# Altium project IPG.PrjPcb (part 9 of 13)

## Sheet 11-Stimulation.SchDoc: Stimulation
size A2; DocumentNumber: 11; SheetNumber: 11; SheetTotal: 15
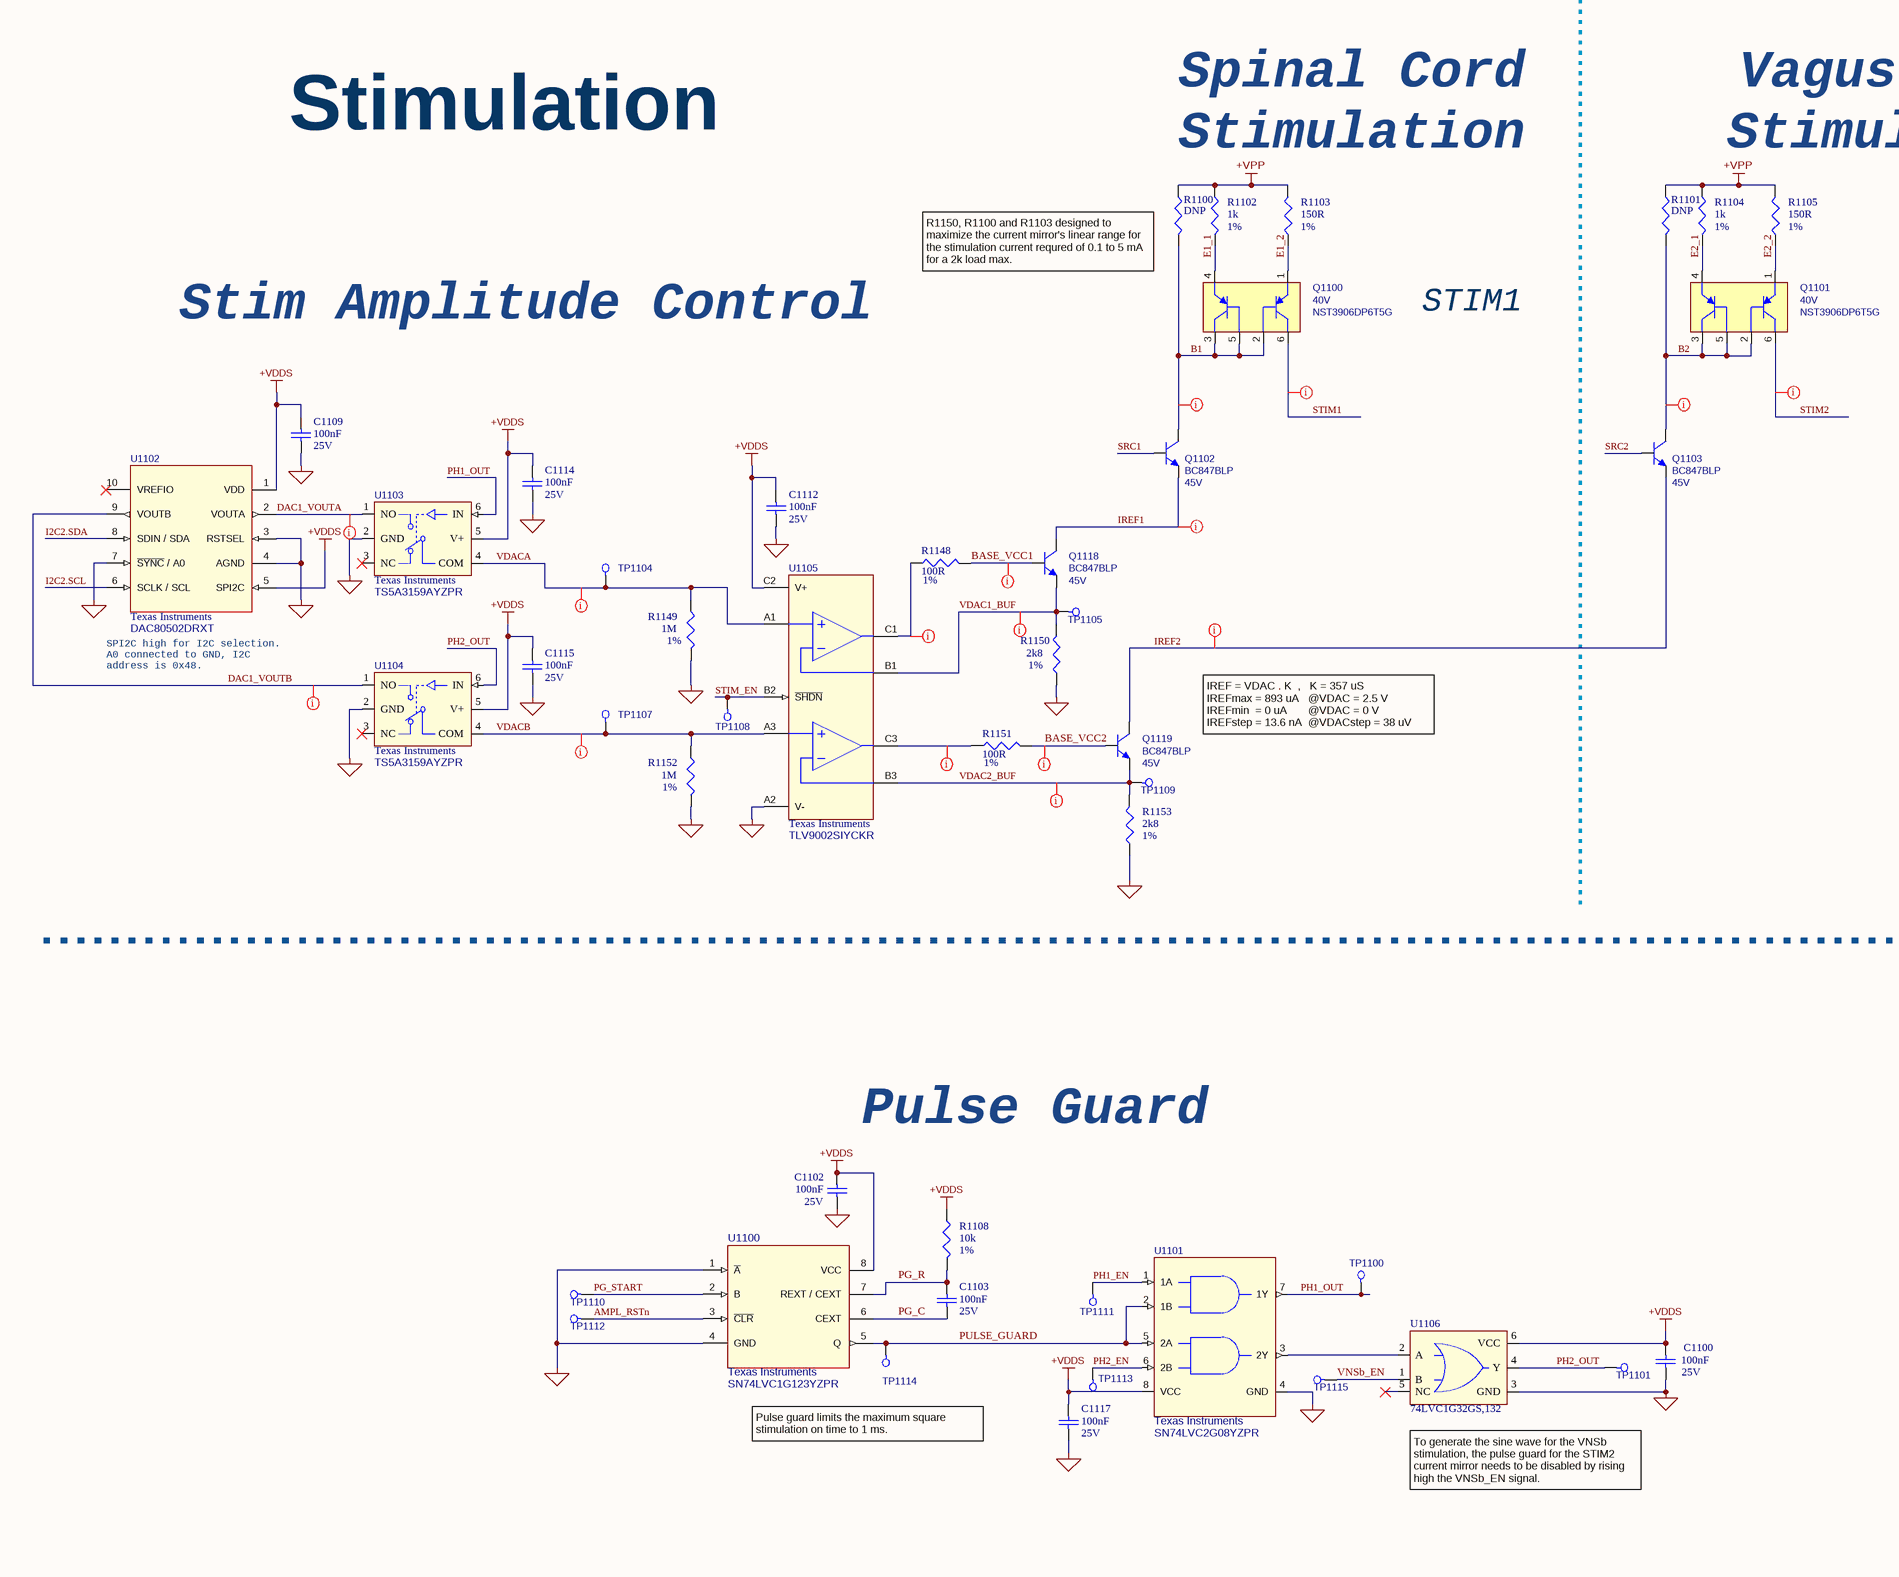
[diagram p23: 11-Stimulation.SchDoc, left]
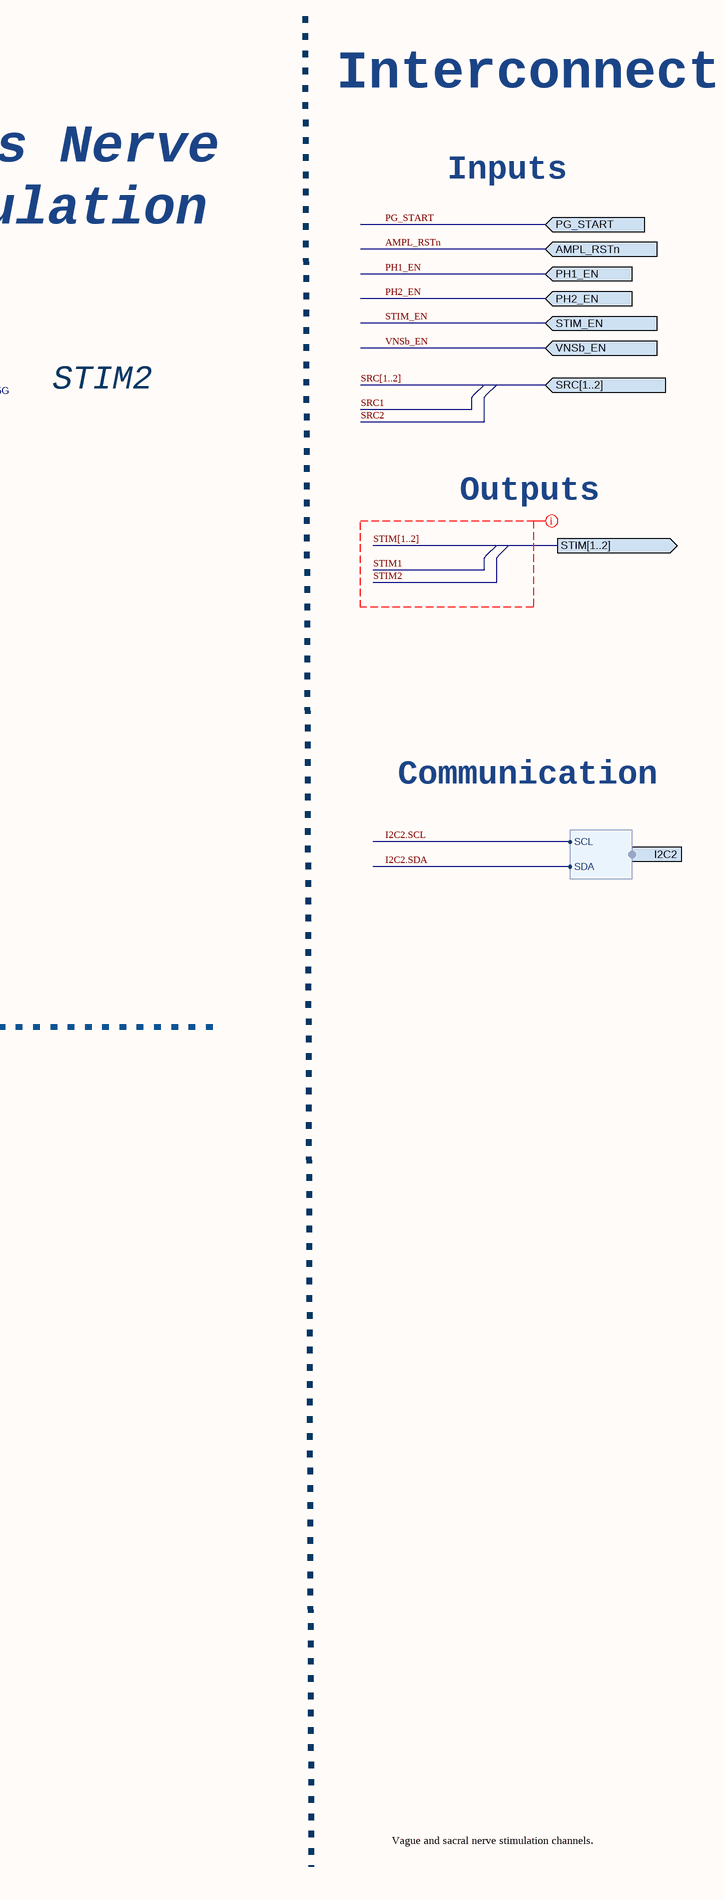
[diagram p24: 11-Stimulation.SchDoc, right]

### Parts
C1100  value 100nF  Rated DC Voltage (URdc): 25V  [C0201_C]  (hidden comment: GRM033R61E104KE14J)
C1102  value 100nF  Rated DC Voltage (URdc): 25V  [C0201_C]  (hidden comment: GRM033R61E104KE14J)
C1103  value 100nF  Rated DC Voltage (URdc): 25V  [C0201_C]  (hidden comment: GRM033R61E104KE14J)
C1109  value 100nF  Rated DC Voltage (URdc): 25V  [C0201_C]  (hidden comment: GRM033R61E104KE14J)
C1112  value 100nF  Rated DC Voltage (URdc): 25V  [C0201_C]  (hidden comment: GRM033R61E104KE14J)
C1114  value 100nF  Rated DC Voltage (URdc): 25V  [C0201_C]  (hidden comment: GRM033R61E104KE14J)
C1115  value 100nF  Rated DC Voltage (URdc): 25V  [C0201_C]  (hidden comment: GRM033R61E104KE14J)
C1117  value 100nF  Rated DC Voltage (URdc): 25V  [C0201_C]  (hidden comment: GRM033R61E104KE14J)
Q1100  Rating: 40V  [DIODESINC_SOT-963-6]  (hidden comment: NST3906DP6T5G)
Q1101  Rating: 40V  [DIODESINC_SOT-963-6]  (hidden comment: NST3906DP6T5G)
Q1102  value BC847BLP  Rating: 45V  [DIODESINC_X1-DFN1006-3]  (hidden comment: BC847BLP-7B)
Q1103  value BC847BLP  Rating: 45V  [DIODESINC_X1-DFN1006-3]  (hidden comment: BC847BLP-7B)
Q1118  value BC847BLP  Rating: 45V  [DIODESINC_X1-DFN1006-3]  (hidden comment: BC847BLP-7B)
Q1119  value BC847BLP  Rating: 45V  [DIODESINC_X1-DFN1006-3]  (hidden comment: BC847BLP-7B)
R1100  value DNP  [R0201_C]  (hidden comment: RES_DNP_0201)  (no BOM)
R1101  value DNP  [R0201_C]  (hidden comment: RES_DNP_0201)  (no BOM)
R1102  value 1k  Tolerance: 1%  [R0201_C]  (hidden comment: CRCW02011K00FNED)
R1103  value 150R  Tolerance: 1%  [R0201_C]  (hidden comment: CRCW0201150RFNED)
R1104  value 1k  Tolerance: 1%  [R0201_C]  (hidden comment: CRCW02011K00FNED)
R1105  value 150R  Tolerance: 1%  [R0201_C]  (hidden comment: CRCW0201150RFNED)
R1108  value 10k  Tolerance: 1%  [R0201_C]  (hidden comment: CRCW020110K0FNED)
R1148  value 100R  Tolerance: 1%  [R0201_C]  (hidden comment: CRCW0201100RFNED)
R1149  value 1M  Tolerance: 1%  [R0201_C]  (hidden comment: CRCW02011M00FNED)
R1150  value 2k8  Tolerance: 1%  [R0201_C]  (hidden comment: CRCW02012K80FNED)
R1151  value 100R  Tolerance: 1%  [R0201_C]  (hidden comment: CRCW0201100RFNED)
R1152  value 1M  Tolerance: 1%  [R0201_C]  (hidden comment: CRCW02011M00FNED)
R1153  value 2k8  Tolerance: 1%  [R0201_C]  (hidden comment: CRCW02012K80FNED)
TP1100  Test Point  [testpad_0.9mm]  (value not drawn)  (no BOM)
TP1101  Test Point  [testpad_0.9mm]  (value not drawn)  (no BOM)
TP1104  Test Point  [testpad_0.9mm]  (value not drawn)  (no BOM)
TP1105  Test Point  [testpad_0.9mm]  (value not drawn)  (no BOM)
TP1107  Test Point  [testpad_0.9mm]  (value not drawn)  (no BOM)
TP1108  Test Point  [testpad_0.9mm]  (value not drawn)  (no BOM)
TP1109  Test Point  [testpad_0.9mm]  (value not drawn)  (no BOM)
TP1110  Test Point  [testpad_0.9mm]  (value not drawn)  (no BOM)
TP1111  Test Point  [testpad_0.9mm]  (value not drawn)  (no BOM)
TP1112  Test Point  [testpad_0.9mm]  (value not drawn)  (no BOM)
TP1113  Test Point  [testpad_0.9mm]  (value not drawn)  (no BOM)
TP1114  Test Point  [testpad_0.9mm]  (value not drawn)  (no BOM)
TP1115  Test Point  [testpad_0.9mm]  (value not drawn)  (no BOM)
U1100  Manufacturer: Texas Instruments  [TI_YZP0008]  (hidden comment: SN74LVC1G123YZPR)
U1101  Manufacturer: Texas Instruments  [TI_YZP0008]  (hidden comment: SN74LVC2G08YZPR)
U1102  Manufacturer: Texas Instruments  [TI_DRX0010A]  (hidden comment: DAC80502DRXT)
U1103  Manufacturer: Texas Instruments  [TI_YZP6]  (hidden comment: TS5A3159AYZPR)
U1104  Manufacturer: Texas Instruments  [TI_YZP6]  (hidden comment: TS5A3159AYZPR)
U1105  Manufacturer: Texas Instruments  [TI_YCK0009]  (hidden comment: TLV9002SIYCKR)
U1106  74LVC1G32GS,132  [74LVC1G3157GS132]

### Ports
AMPL_RSTn (in), I2C2 (harness I2C), PG_START (in), PH1_EN (in), PH2_EN (in), SRC[1..2] (in), STIM[1..2] (out), STIM_EN (in), VNSb_EN (in)

### Harnesses
I2C: SDA, SCL

### Nets
+VDDS: C1100.2 C1102.2 C1109.2 C1112.2 C1114.2 C1115.2 C1117.2 R1108.1 U1100.8(VCC) U1101.8(VCC) U1102.1(VDD) U1102.5(SPI2C) U1103.5(V+) U1104.5(V+) U1105.C2(V+) U1106.6(VCC)
+VPP: R1100.1 R1101.1 R1102.1 R1103.2 R1104.1 R1105.2
GND: C1100.1 C1102.1 C1109.1 C1112.1 C1114.1 C1115.1 C1117.1 R1149.2 R1150.1 R1152.2 R1153.1 U1100.1(~{A}) U1100.4(GND) U1101.4(GND) U1102.3(RSTSEL) U1102.4(AGND) U1102.7(~{SYNC}_/_A0) U1103.2(GND) U1104.2(GND) U1105.A2(V-) U1106.3(GND)
AMPL_RSTn: TP1112.1 U1100.3(~{CLR}) ; port AMPL_RSTn
B1: Q1100.2(B2) Q1100.3(C1) Q1100.5(B1) Q1102.3(C) R1100.2
B2: Q1101.2(B2) Q1101.3(C1) Q1101.5(B1) Q1103.3(C) R1101.2
BASE_VCC1: Q1118.1(B) R1148.2
BASE_VCC2: Q1119.1(B) R1151.2
DAC1_VOUTA: U1102.2(VOUTA) U1103.1(NO)
DAC1_VOUTB: U1102.9(VOUTB) U1104.1(NO)
E1_1: Q1100.4(E1) R1102.2
E1_2: Q1100.1(E2) R1103.1
E2_1: Q1101.4(E1) R1104.2
E2_2: Q1101.1(E2) R1105.1
I2C2.SCL: U1102.6(SCLK_/_SCL) ; port I2C2.SCL
I2C2.SDA: U1102.8(SDIN_/_SDA) ; port I2C2.SDA
IREF1: Q1102.2(E) Q1118.3(C)
IREF2: Q1103.2(E) Q1119.3(C)
PG_C: C1103.1 U1100.6(CEXT)
PG_R: C1103.2 R1108.2 U1100.7(REXT_/_CEXT)
PG_START: TP1110.1 U1100.2(B) ; port PG_START
PH1_EN: TP1111.1 U1101.1(1A) ; port PH1_EN
PH1_OUT: TP1100.1 U1101.7(1Y) U1103.6(IN)
PH2_EN: TP1113.1 U1101.6(2B) ; port PH2_EN
PH2_OUT: TP1101.1 U1104.6(IN) U1106.4(Y)
PULSE_GUARD: TP1114.1 U1100.5(Q) U1101.2(1B) U1101.5(2A)
SRC1: Q1102.1(B)
SRC2: Q1103.1(B)
STIM1: Q1100.6(C2)
STIM2: Q1101.6(C2)
STIM_EN: TP1108.1 U1105.B2(~{SHDN}) ; port STIM_EN
VDAC1_BUF: Q1118.2(E) R1150.2 TP1105.1 U1105.B1(IN1-)
VDAC2_BUF: Q1119.2(E) R1153.2 TP1109.1 U1105.B3(IN2-)
VDACA: R1149.1 TP1104.1 U1103.4(COM) U1105.A1(IN1+)
VDACB: R1152.1 TP1107.1 U1104.4(COM) U1105.A3(IN2+)
VNSb_EN: TP1115.1 U1106.1(B) ; port VNSb_EN
NetR1148_1: R1148.1 U1105.C1(OUT1)
NetR1151_1: R1151.1 U1105.C3(OUT2)
NetU1101_3: U1101.3(2Y) U1106.2(A)

Not connected (* = marked no-connect by the designer): U1102 10(VREFIO)*; U1103 3(NC)*; U1104 3(NC)*; U1106 5(NC)*

### Buses and harness runs
bus SRC[1..2] = port SRC[1..2]
bus STIM[1..2] = port STIM[1..2]

### Layout directives
net class ANALOG: B1, B2, BASE_VCC1, BASE_VCC2, DAC1_VOUTA, DAC1_VOUTB, IREF1, IREF2, NetR1148_1, NetR1151_1, STIM1, STIM2, STIM[1..2], VDAC1_BUF, VDAC2_BUF, VDACA, VDACB

### Notes on the sheet
- Interconnect
- Spinal Cord
- Vagus Nerve
- Inputs
- Stimulation
- (near R1100) R1150, R1100 and R1103 designed to maximize the current mirror's linear range for the stimulation current requred of 0.1 to 5 mA for a 2k load max.
- Stim Amplitude Control
- STIM1
- STIM2
- Outputs
- SPI2C high for I2C selection. A0 connected to GND, I2C address is 0x48.
- Communication
- IREF = VDAC . K  ,   K = 357 uS
  IREFmax = 893 uA   @VDAC = 2.5 V
  IREFmin  = 0 uA       @VDAC = 0 V
  IREFstep = 13.6 nA  @VDACstep = 38 uV
- Pulse Guard
- Pulse guard limits the maximum square stimulation on time to 1 ms.
- (near U1106) To generate the sine wave for the VNSb stimulation, the pulse guard for the STIM2 current mirror needs to be disabled by rising high the VNSb_EN signal.
- Vague and sacral nerve stimulation channels.
- Project:
- Schematic:
- Design by:
- Date:
- Ver:
- .
- Comments:
- Reviewed by:

### Library data of the parts
C1100 C1102 C1103 C1109 C1112 C1114 C1115 C1117 = GRM033R61E104KE14J: as C1003-C1006 on sheet 10-Sensing; Category: Ceramic Capacitors; Supplier: Digikey; Supplier Part Number: 490-14571-1-ND; Manufacturer Part Number: GRM033R61E104KE14J; RoHS: Yes; Stock: 1540851; Pricing: 1=0,1, 10=0,033, 50=0,0192, 100=0,0148, 500=0,01118, 1000=0,00878, 2500=0,00798, 5000=0,00734 (USD); Mounting Technology: Surface Mount; Pins: 2; Dielectric Material: Ceramic; Package Shape: Rectangular; Case/Package: 0201; Terminal Finish: Nickel; Min Operating Temperature: -55°C; Max Operating Temperature: 85°C; JESD-609 Code: e3; Capacitor Type: Ceramic; Tolerance  (fill in as +-): 10%; Package Style: SMTMeter; Packaging: Tape and Reel; Tolerance (fill in as +-): 10%; Temperature Characteristics Code: X5R; Termination: Wraparound; Length: 0.6mm; Width: 0.3mm; Height: 0.3mm; Reach SVHC Compliant: Yes; RoHS Compliant: Yes; ComponentLink1URL: https://psearch.en.murata.com:443/capacitor/product/GRM033R61E104KE14%23.pdf?src-supplier=IHS+Markit; ComponentLink1Description: https://psearch.en.murata.com:443/capacitor/product/GRM033R61E104KE14%23.pdf?src-supplier=IHS+Markit; ComponentLink2URL: http://www.mouser.com/ds/2/281/c02e-2905.pdf?src-supplier=Mouser; ComponentLink2Description: http://www.mouser.com/ds/2/281/c02e-2905.pdf?src-supplier=Mouser; ComponentLink3URL: http://search.murata.co.jp/Ceramy/image/img/A01X/G101/ENG/GRM033R61E104KE14-01.pdf?src-supplier=Digikey; ComponentLink3Description: http://search.murata.co.jp/Ceramy/image/img/A01X/G101/ENG/GRM033R61E104KE14-01.pdf?src-supplier=Digikey; ComponentLink4URL: https://search.murata.co.jp/Ceramy/image/img/A01X/G101/ENG/GRM033R61E104KE14-01.pdf?src-supplier=Digikey; ComponentLink4Description: https://search.murata.co.jp/Ceramy/image/img/A01X/G101/ENG/GRM033R61E104KE14-01.pdf?src-supplier=Digikey; Supplier 1: Arrow Electronics; Supplier Part Number 1: GRM033R61E104KE14J
Q1100 Q1101 = NST3906DP6T5G: TRANS 2PNP 40V 0.2A SOT963; Manufacturer: ON Semi; Medical Grade MFR: TBD; Category: Transistor; Length (mm): 1.00 ±0.05; Medical Grade MFR PN: TBD; PCB Footprint: TBD; Thickness (mm): 0.45 ±0.05; Value: NST3906DP6T5G; Width (mm): 1.00 ±0.05; Package Description: SOT963; Supplier 1: Digi-Key; Supplier Part Number 1: NST3906DP6T5GOSCT-ND; Status: *; Review: *; Manufacturer Part Number: NST3906DP6T5G
Q1102 Q1103 Q1118 Q1119 = BC847BLP-7B: Transistor, NPN, 45V, 100mA, DFN1006; Manufacturer: Diodes Inc; Medical Grade MFR: TBD; Category: Transistor; Length (mm): 1.00 ±0.08; Medical Grade MFR PN: TBD; PCB Footprint: TBD; Thickness (mm): 0.50 ±0.03; Width (mm): 0.60 ±0.08; Supplier 1: Digi-Key; Supplier Part Number 1: BC847BLP-7BDICT-ND; Status: *; Review: *; Manufacturer Part Number: BC847BLP-7B
R1102 R1104 = CRCW02011K00FNED: Fixed Resistor, Metal Glaze/thick Film, 0.05W, 1000ohm, 30V, 1% +/-Tol, 200ppm/Cel, Surface Mount, 0201; Manufacturer: Vishay; Medical Grade MFR: Mini-Systems; Medical Grade MFR PN: MWA96SM-1001F-NS62TR; Power: 50mW; Rated Temperature: 70°C; Temperature Coefficient: 200ppm/°C; Package Height: 0.23mm; Package Length: 0.6mm; Package Width: 0.3mm; Reference Standard: AEC-Q200; Category: Chip SMD Resistors; Supplier: Digikey; Supplier Part Number: 541-1.00KABCT-ND; Manufacturer Part Number: CRCW02011K00FNED; RoHS: Yes; Stock: 303224; Pricing: 1=0,1, 10=0,037, 50=0,0242, 100=0,0204, 500=0,01426, 1000=0,01241, 5000=0,00924 (USD); Mounting Technology: Surface Mount; Pins: 2; Package Shape: Rectangular; Case/Package: 0201; Terminal Finish: Nickel; Min Operating Temperature: -55°C; Max Operating Temperature: 155°C; JESD-609 Code: e3; Resistor Type: FIXED RESISTOR; Construction: Chip; Package Style: SMTMeter; Packaging: Tape and Reel; Technology: METAL GLAZE/THICK FILM; Termination: Wraparound; Working Voltage: 30V; Reach SVHC Compliant: Yes; RoHS Compliant: Yes; ComponentLink1URL: https://datasheet.ciiva.com:443/pdfs/VipMasterIC/IC/VISH/VISH-S-A0002932828/VISH-S-A0002932828-1.pdf?src-supplier=IHS+Markit; ComponentLink1Description: https://datasheet.ciiva.com:443/pdfs/VipMasterIC/IC/VISH/VISH-S-A0002932828/VISH-S-A0002932828-1.pdf?src-supplier=IHS+Markit; ComponentLink2URL: https://datasheet.ciiva.com/7983/1719906-7983324.pdf?src-supplier=Element14; ComponentLink2Description: https://datasheet.ciiva.com/7983/1719906-7983324.pdf?src-supplier=Element14; ComponentLink3URL: https://datasheet.ciiva.com/7983/1719906-7983323.pdf?src-supplier=Element14; ComponentLink3Description: https://datasheet.ciiva.com/7983/1719906-7983323.pdf?src-supplier=Element14; ComponentLink4URL: https://datasheet.ciiva.com/22692/1719906-22692751.pdf?src-supplier=Element14; ComponentLink4Description: https://datasheet.ciiva.com/22692/1719906-22692751.pdf?src-supplier=Element14; ComponentLink5URL: https://datasheet.ciiva.com/22665/1825492-22665818.pdf?src-supplier=Element14; ComponentLink5Description: https://datasheet.ciiva.com/22665/1825492-22665818.pdf?src-supplier=Element14; ComponentLink6URL: https://datasheet.ciiva.com/2474/crcw0201e3-2474801.pdf?src-supplier=Digikey; ComponentLink6Description: https://datasheet.ciiva.com/2474/crcw0201e3-2474801.pdf?src-supplier=Digikey; ComponentLink7URL: https://datasheet.ciiva.com/2474/crcw0201e3-2474802.pdf?src-supplier=Digikey; ComponentLink7Description: https://datasheet.ciiva.com/2474/crcw0201e3-2474802.pdf?src-supplier=Digikey; ComponentLink8URL: https://datasheet.ciiva.com/2474/crcw0201e3-2474800.pdf?src-supplier=Digikey; ComponentLink8Description: https://datasheet.ciiva.com/2474/crcw0201e3-2474800.pdf?src-supplier=Digikey; ComponentLink9URL: https://datasheet.ciiva.com/22871/70202042-22871422.pdf?src-supplier=Allied+Electronics; ComponentLink9Description: https://datasheet.ciiva.com/22871/70202042-22871422.pdf?src-supplier=Allied+Electronics; ComponentLink10URL: https://datasheet.ciiva.com/3255/crcw0201e3-3255929.pdf?src-supplier=Avnet; ComponentLink10Description: https://datasheet.ciiva.com/3255/crcw0201e3-3255929.pdf?src-supplier=Avnet; Supplier 1: Arrow Electronics; Supplier Part Number 1: CRCW02011K00FNED
R1103 R1105 = CRCW0201150RFNED: Fixed Resistor, Metal Glaze/thick Film, 0.05W, 150ohm, 30V, 1% +/-Tol, 200ppm/Cel, Surface Mount, 0201; Manufacturer: Vishay; Medical Grade MFR: Mini-Systems; Medical Grade MFR PN: MWA96SM-1500F-NS62TR; Power: 50mW; Rated Temperature: 70°C; Temperature Coefficient: 200ppm/°C; Package Height: 0.23mm; Package Length: 0.6mm; Package Width: 0.3mm; Reference Standard: AEC-Q200; Category: Chip SMD Resistors; Supplier: Digikey; Supplier Part Number: 541-CRCW0201150RFNEDCT-ND; Manufacturer Part Number: CRCW0201150RFNED; RoHS: Yes; Stock: 19000; Pricing: 1=0,1, 10=0,037, 50=0,0242, 100=0,0204, 500=0,01426, 1000=0,01241, 5000=0,00924 (USD); Mounting Technology: Surface Mount; Pins: 2; Package Shape: Rectangular; Case/Package: 0201; Terminal Finish: Nickel; Min Operating Temperature: -55°C; Max Operating Temperature: 155°C; JESD-609 Code: e3; Resistor Type: FIXED RESISTOR; Construction: Chip; Package Style: SMTMeter; Packaging: Tape and Reel; Technology: METAL GLAZE/THICK FILM; Termination: Wraparound; Working Voltage: 30V; Reach SVHC Compliant: Yes; RoHS Compliant: Yes; ComponentLink1URL: https://datasheet.ciiva.com:443/pdfs/VipMasterIC/IC/VISH/VISH-S-A0002932828/VISH-S-A0002932828-1.pdf?src-supplier=IHS+Markit; ComponentLink1Description: https://datasheet.ciiva.com:443/pdfs/VipMasterIC/IC/VISH/VISH-S-A0002932828/VISH-S-A0002932828-1.pdf?src-supplier=IHS+Markit; ComponentLink2URL: https://datasheet.ciiva.com/2577/crcw0201e3-2577126.pdf?src-supplier=Digikey; ComponentLink2Description: https://datasheet.ciiva.com/2577/crcw0201e3-2577126.pdf?src-supplier=Digikey; ComponentLink3URL: https://datasheet.ciiva.com/8969/crcw0201e3-8969797.pdf?src-supplier=Avnet; ComponentLink3Description: https://datasheet.ciiva.com/8969/crcw0201e3-8969797.pdf?src-supplier=Avnet; ComponentLink4URL: https://datasheet.ciiva.com/7777/1719906-7777159.pdf?src-supplier=Element14; ComponentLink4Description: https://datasheet.ciiva.com/7777/1719906-7777159.pdf?src-supplier=Element14; ComponentLink5URL: https://datasheet.ciiva.com/7777/1719906-7777160.pdf?src-supplier=Element14; ComponentLink5Description: https://datasheet.ciiva.com/7777/1719906-7777160.pdf?src-supplier=Element14; Supplier 1: Digikey; Supplier Part Number 1: 541-CRCW0201150RFNEDCT-ND
R1108 = CRCW020110K0FNED: Fixed Resistor, Metal Glaze/thick Film, 0.05W, 10000ohm, 30V, 1% +/-Tol, 200ppm/Cel, Surface Mount, 0201; Manufacturer: Vishay; Medical Grade MFR: Mini-Systems; Medical Grade MFR PN: MWA96SM-1002F-NS62TR; Power: 50mW; Rated Temperature: 70°C; Temperature Coefficient: 200ppm/°C; Package Height: 0.23mm; Package Length: 0.6mm; Package Width: 0.3mm; Reference Standard: AEC-Q200; Category: Chip SMD Resistors; Supplier: Digikey; Supplier Part Number: 541-10.0KABCT-ND; Manufacturer Part Number: CRCW020110K0FNED; RoHS: Yes; Stock: 1011530; Pricing: 1=0,1, 10=0,037, 50=0,0242, 100=0,0204, 500=0,01426, 1000=0,01241, 5000=0,00924 (USD); Mounting Technology: Surface Mount; Pins: 2; Package Shape: Rectangular; Case/Package: 0201; Terminal Finish: Nickel; Min Operating Temperature: -55°C; Max Operating Temperature: 155°C; JESD-609 Code: e3; Resistor Type: FIXED RESISTOR; Construction: Chip; Package Style: SMTMeter; Packaging: Tape and Reel; Technology: METAL GLAZE/THICK FILM; Termination: Wraparound; Working Voltage: 30V; Reach SVHC Compliant: Yes; RoHS Compliant: Yes; ComponentLink1URL: https://datasheet.ciiva.com:443/pdfs/VipMasterIC/IC/VISH/VISH-S-A0002932828/VISH-S-A0002932828-1.pdf?src-supplier=IHS+Markit; ComponentLink1Description: https://datasheet.ciiva.com:443/pdfs/VipMasterIC/IC/VISH/VISH-S-A0002932828/VISH-S-A0002932828-1.pdf?src-supplier=IHS+Markit; ComponentLink2URL: https://datasheet.ciiva.com/2474/crcw0201e3-2474819.pdf?src-supplier=Digikey; ComponentLink2Description: https://datasheet.ciiva.com/2474/crcw0201e3-2474819.pdf?src-supplier=Digikey; ComponentLink3URL: https://datasheet.ciiva.com/2474/crcw0201e3-2474820.pdf?src-supplier=Digikey; ComponentLink3Description: https://datasheet.ciiva.com/2474/crcw0201e3-2474820.pdf?src-supplier=Digikey; ComponentLink4URL: https://datasheet.ciiva.com/2474/crcw0201e3-2474818.pdf?src-supplier=Digikey; ComponentLink4Description: https://datasheet.ciiva.com/2474/crcw0201e3-2474818.pdf?src-supplier=Digikey; ComponentLink5URL: https://datasheet.ciiva.com/16436/dcrcwe3-16436222.pdf?src-supplier=Future+Electronics; ComponentLink5Description: https://datasheet.ciiva.com/16436/dcrcwe3-16436222.pdf?src-supplier=Future+Electronics; ComponentLink6URL: https://datasheet.ciiva.com/7983/1719906-7983320.pdf?src-supplier=Element14; ComponentLink6Description: https://datasheet.ciiva.com/7983/1719906-7983320.pdf?src-supplier=Element14; ComponentLink7URL: https://datasheet.ciiva.com/7983/1719906-7983319.pdf?src-supplier=Element14; ComponentLink7Description: https://datasheet.ciiva.com/7983/1719906-7983319.pdf?src-supplier=Element14; ComponentLink8URL: https://datasheet.ciiva.com/22692/1719906-22692709.pdf?src-supplier=Element14; ComponentLink8Description: https://datasheet.ciiva.com/22692/1719906-22692709.pdf?src-supplier=Element14; Supplier 1: Mouser; Supplier Part Number 1: 71-CRCW0201-10K
R1148 R1151 = CRCW0201100RFNED: Fixed Resistor, Metal Glaze/thick Film, 0.05W, 100ohm, 30V, 1% +/-Tol, 200ppm/Cel, Surface Mount, 0201; Manufacturer: Vishay; Medical Grade MFR: Mini-Systems; Medical Grade MFR PN: MWA96SM-1000F-NS62TR; Power: 50mW; Rated Temperature: 70°C; Temperature Coefficient: 200ppm/°C; Package Height: 0.23mm; Package Length: 0.6mm; Package Width: 0.3mm; Reference Standard: AEC-Q200; Category: Chip SMD Resistors; Supplier: Digikey; Supplier Part Number: 541-100ABCT-ND; Manufacturer Part Number: CRCW0201100RFNED; RoHS: Yes; Stock: 52904; Pricing: 1=0,1, 10=0,037, 50=0,0242, 100=0,0204, 500=0,01426, 1000=0,01241, 5000=0,00924 (USD); Mounting Technology: Surface Mount; Pins: 2; Package Shape: Rectangular; Terminal Finish: Nickel; Case/Package: 0201; Min Operating Temperature: -55°C; Max Operating Temperature: 155°C; JESD-609 Code: e3; Package Style: SMTMeter; Technology: METAL GLAZE/THICK FILM; Resistor Type: FIXED RESISTOR; Construction: Chip; Packaging: Tape and Reel; Termination: Wraparound; Working Voltage: 30V; Reach SVHC Compliant: Yes; RoHS Compliant: Yes; ComponentLink1URL: https://datasheet.ciiva.com:443/pdfs/VipMasterIC/IC/VISH/VISH-S-A0002932828/VISH-S-A0002932828-1.pdf?src-supplier=IHS+Markit; ComponentLink1Description: https://datasheet.ciiva.com:443/pdfs/VipMasterIC/IC/VISH/VISH-S-A0002932828/VISH-S-A0002932828-1.pdf?src-supplier=IHS+Markit; ComponentLink2URL: https://datasheet.ciiva.com/8083/crcw0201e3-8083961.pdf?src-supplier=Avnet; ComponentLink2Description: https://datasheet.ciiva.com/8083/crcw0201e3-8083961.pdf?src-supplier=Avnet; ComponentLink3URL: https://datasheet.ciiva.com/2527/crcw0201e3-2527593.pdf?src-supplier=Digikey; ComponentLink3Description: https://datasheet.ciiva.com/2527/crcw0201e3-2527593.pdf?src-supplier=Digikey; ComponentLink4URL: https://datasheet.ciiva.com/2527/crcw0201e3-2527591.pdf?src-supplier=Digikey; ComponentLink4Description: https://datasheet.ciiva.com/2527/crcw0201e3-2527591.pdf?src-supplier=Digikey; ComponentLink5URL: https://datasheet.ciiva.com/2527/crcw0201e3-2527592.pdf?src-supplier=Digikey; ComponentLink5Description: https://datasheet.ciiva.com/2527/crcw0201e3-2527592.pdf?src-supplier=Digikey; ComponentLink6URL: https://datasheet.ciiva.com/7983/1719906-7983317.pdf?src-supplier=Element14; ComponentLink6Description: https://datasheet.ciiva.com/7983/1719906-7983317.pdf?src-supplier=Element14; ComponentLink7URL: https://datasheet.ciiva.com/7983/1719906-7983318.pdf?src-supplier=Element14; ComponentLink7Description: https://datasheet.ciiva.com/7983/1719906-7983318.pdf?src-supplier=Element14; ComponentLink8URL: https://datasheet.ciiva.com/16757/70202042-16757607.pdf?src-supplier=Allied+Electronics; ComponentLink8Description: https://datasheet.ciiva.com/16757/70202042-16757607.pdf?src-supplier=Allied+Electronics; ComponentLink9URL: https://datasheet.ciiva.com/16202/dcrcwe3-16202605.pdf?src-supplier=Future+Electronics; ComponentLink9Description: https://datasheet.ciiva.com/16202/dcrcwe3-16202605.pdf?src-supplier=Future+Electronics; ComponentLink10URL: https://datasheet.ciiva.com/22665/1700795-22665690.pdf?src-supplier=Element14; ComponentLink10Description: https://datasheet.ciiva.com/22665/1700795-22665690.pdf?src-supplier=Element14; Supplier 1: Digikey; Supplier Part Number 1: 541-100ABCT-ND
R1149 R1152 = CRCW02011M00FNED: as R1024 on sheet 10-Sensing; Category: Chip SMD Resistors; Supplier: Digikey; Supplier Part Number: 541-1.00MABCT-ND; Manufacturer Part Number: CRCW02011M00FNED; RoHS: Yes; Stock: 392914; Pricing: 1=0,1, 10=0,037, 50=0,0242, 100=0,0204, 500=0,01426, 1000=0,01241, 5000=0,00924 (USD); Mounting Technology: Surface Mount; Pins: 2; Package Shape: Rectangular; Case/Package: 0201; Terminal Finish: Nickel; Min Operating Temperature: -55°C; Max Operating Temperature: 155°C; JESD-609 Code: e3; Resistor Type: FIXED RESISTOR; Construction: Chip; Package Style: SMTMeter; Packaging: Tape and Reel; Technology: METAL GLAZE/THICK FILM; Termination: Wraparound; Working Voltage: 30V; Reach SVHC Compliant: Yes; RoHS Compliant: Yes; ComponentLink1URL: https://datasheet.ciiva.com:443/pdfs/VipMasterIC/IC/VISH/VISH-S-A0002932828/VISH-S-A0002932828-1.pdf?src-supplier=IHS+Markit; ComponentLink1Description: https://datasheet.ciiva.com:443/pdfs/VipMasterIC/IC/VISH/VISH-S-A0002932828/VISH-S-A0002932828-1.pdf?src-supplier=IHS+Markit; ComponentLink2URL: https://datasheet.ciiva.com/7841/1719906-7841438.pdf?src-supplier=Element14; ComponentLink2Description: https://datasheet.ciiva.com/7841/1719906-7841438.pdf?src-supplier=Element14; ComponentLink3URL: https://datasheet.ciiva.com/7841/1719906-7841439.pdf?src-supplier=Element14; ComponentLink3Description: https://datasheet.ciiva.com/7841/1719906-7841439.pdf?src-supplier=Element14; ComponentLink4URL: https://datasheet.ciiva.com/7859/dcrcwe3-7859689.pdf?src-supplier=Element14; ComponentLink4Description: https://datasheet.ciiva.com/7859/dcrcwe3-7859689.pdf?src-supplier=Element14; ComponentLink5URL: https://datasheet.ciiva.com/16757/70202042-16757675.pdf?src-supplier=Allied+Electronics; ComponentLink5Description: https://datasheet.ciiva.com/16757/70202042-16757675.pdf?src-supplier=Allied+Electronics; ComponentLink6URL: https://datasheet.ciiva.com/22692/1719906-22692761.pdf?src-supplier=Element14; ComponentLink6Description: https://datasheet.ciiva.com/22692/1719906-22692761.pdf?src-supplier=Element14; ComponentLink7URL: https://datasheet.ciiva.com/9109/crcw0201e3-9109910.pdf?src-supplier=Avnet; ComponentLink7Description: https://datasheet.ciiva.com/9109/crcw0201e3-9109910.pdf?src-supplier=Avnet; ComponentLink8URL: https://datasheet.ciiva.com/22675/1847332-22675065.pdf?src-supplier=Element14; ComponentLink8Description: https://datasheet.ciiva.com/22675/1847332-22675065.pdf?src-supplier=Element14; ComponentLink9URL: https://datasheet.ciiva.com/2474/crcw0201e3-2474824.pdf?src-supplier=Digikey; ComponentLink9Description: https://datasheet.ciiva.com/2474/crcw0201e3-2474824.pdf?src-supplier=Digikey; ComponentLink10URL: https://datasheet.ciiva.com/2474/crcw0201e3-2474825.pdf?src-supplier=Digikey; ComponentLink10Description: https://datasheet.ciiva.com/2474/crcw0201e3-2474825.pdf?src-supplier=Digikey; ComponentLink11URL: https://datasheet.ciiva.com/2474/crcw0201e3-2474826.pdf?src-supplier=Digikey; ComponentLink11Description: https://datasheet.ciiva.com/2474/crcw0201e3-2474826.pdf?src-supplier=Digikey; Supplier 1: Digikey; Supplier Part Number 1: 541-1.00MABCT-ND
R1150 R1153 = CRCW02012K80FNED: Fixed Resistor, Metal Glaze/thick Film, 0.05W, 2800ohm, 30V, 1% +/-Tol, 200ppm/Cel, Surface Mount, 0201; Manufacturer: Vishay; Medical Grade MFR: Mini-Systems; Medical Grade MFR PN: MWA96SM-2801F-NS62TR; Power: 50mW; Rated Temperature: 70°C; Temperature Coefficient: 200ppm/°C; Package Height: 0.23mm; Package Length: 0.6mm; Package Width: 0.3mm; Reference Standard: AEC-Q200; Category: Chip SMD Resistors; Supplier: Digikey; Supplier Part Number: 541-CRCW02012K80FNEDCT-ND; Manufacturer Part Number: CRCW02012K80FNED; RoHS: Yes; Stock: 8141; Pricing: 1=0,1, 10=0,037, 50=0,0242, 100=0,0204, 500=0,01426, 1000=0,01241, 5000=0,00924 (USD); Mounting Technology: Surface Mount; Pins: 2; Package Shape: Rectangular; Case/Package: 0201; Terminal Finish: Nickel; Min Operating Temperature: -55°C; Max Operating Temperature: 155°C; JESD-609 Code: e3; Resistor Type: FIXED RESISTOR; Construction: Chip; Package Style: SMTMeter; Packaging: Tape and Reel; Technology: METAL GLAZE/THICK FILM; Termination: Wraparound; Working Voltage: 30V; Reach SVHC Compliant: Yes; RoHS Compliant: Yes; ComponentLink1URL: https://datasheet.ciiva.com:443/pdfs/VipMasterIC/IC/VISH/VISH-S-A0002932828/VISH-S-A0002932828-1.pdf?src-supplier=IHS+Markit; ComponentLink1Description: https://datasheet.ciiva.com:443/pdfs/VipMasterIC/IC/VISH/VISH-S-A0002932828/VISH-S-A0002932828-1.pdf?src-supplier=IHS+Markit; ComponentLink2URL: https://datasheet.ciiva.com/5915/1719906-5915662.pdf?src-supplier=Farnell; ComponentLink2Description: https://datasheet.ciiva.com/5915/1719906-5915662.pdf?src-supplier=Farnell; ComponentLink3URL: https://datasheet.ciiva.com/5915/1719906-5915663.pdf?src-supplier=Farnell; ComponentLink3Description: https://datasheet.ciiva.com/5915/1719906-5915663.pdf?src-supplier=Farnell; ComponentLink4URL: https://datasheet.ciiva.com/7690/1719906-7690602.pdf?src-supplier=Element14; ComponentLink4Description: https://datasheet.ciiva.com/7690/1719906-7690602.pdf?src-supplier=Element14; ComponentLink5URL: https://datasheet.ciiva.com/7690/1719906-7690603.pdf?src-supplier=Element14; ComponentLink5Description: https://datasheet.ciiva.com/7690/1719906-7690603.pdf?src-supplier=Element14; ComponentLink6URL: https://datasheet.ciiva.com/22700/1719906-22700665.pdf?src-supplier=Element14; ComponentLink6Description: https://datasheet.ciiva.com/22700/1719906-22700665.pdf?src-supplier=Element14; Supplier 1: Digikey; Supplier Part Number 1: 541-CRCW02012K80FNEDCT-ND
TP1100 TP1101 TP1104 TP1105 TP1107-TP1115 = Test Point: as TP1000 on sheet 10-Sensing; Length (mm): 0.90; Manufacturer: N/A; Manufacturer PN: N/A; Medical Grade MFR: N/A; Medical Grade MFR PN: N/A; Rating: N/A; Thickness (mm): N/A; Value: Test point; Width (mm): 0.90; Category: Test point; Status: *; Review: *
U1100 = SN74LVC1G123YZPR: Monostable, RC set, dual triggers, BGA-8; Medical Grade MFR: TBD; Category: IC; Length (mm): 1.89 ±0.03; Medical Grade MFR PN: TBD; Package Description: TBD; PCB Footprint: TBD; Rating: TBD; Thickness (mm): 0.50; Value: SN74LVC1G123YZPR; Width (mm): 0.89 ±0.03; Supplier 1: Digi-Key; Supplier Part Number 1: 296-21058-1-ND; Status: *; Review: *; Manufacturer Part Number: SN74LVC1G123YZPR
U1101 = SN74LVC2G08YZPR: AND gate, Dual 2-input, BGA-8; Medical Grade MFR: TBD; Category: IC; Length (mm): 1.89 ±0.03; Medical Grade MFR PN: TBD; Package Description: TBD; PCB Footprint: TBD; Rating: TBD; Thickness (mm): 0.50; Value: SN74LVC2G08YZPR; Width (mm): 0.89 ±0.03; Supplier 1: Digi-Key; Supplier Part Number 1: 296-14371-1-ND; Status: *; Review: *; Manufacturer Part Number: SN74LVC2G08YZPR
U1102 = DAC80502DRXT: DAC, 16-bit, Dual channel, SPI/I2C, WSON-10; Rating: 2.7-5.5V; Category: IC; Length (mm): 2.50 ±0.10; Medical Grade MFR: N/A; Medical Grade MFR PN: N/A; Package Description: N/A; PCB Footprint: N/A; Thickness (mm): 0.75 ±0.05; Value: DAC80502DRXT; Width (mm): 2.50 ±0.10; Supplier 1: Digi-Key; Supplier Part Number 1: 296-DAC80502DRXTCT-ND; Status: *; Review: *; Manufacturer Part Number: DAC80502DRXT
U1103 U1104 = TS5A3159AYZPR: Analog Switch, SPDT, 2:1, DSBGA6; Medical Grade MFR: TBD; Rating: 5.0V; Category: IC; Length (mm): 1.39 ±0.03; Thickness (mm): 0.50 ±0.10; Width (mm): 0.89 ±0.03; Medical Grade MFR PN: TBD; Package Description: TBD; PCB Footprint: TBD; Value: TS5A3159AYZPR; Supplier 1: Digi-Key; Supplier Part Number 1: 296-18671-1-ND; Status: *; Review: *; Manufacturer Part Number: TS5A3159AYZPR
U1105 = TLV9002SIYCKR: Op Amp, Dual, Rail-to-Rail, 1MHz, BGA-9; Medical Grade MFR: TBD; Rating: 5.5V; Category: IC; Length (mm): 0.95 ±0.03; Medical Grade MFR PN: TBD; Package Description: TBD; PCB Footprint: TBD; Thickness (mm): 0.33; Value: TLV9002SIYCKR; Width (mm): 0.95 ±0.03; Supplier 1: Digi-Key; Supplier Part Number 1: 296-TLV9002SIYCKRCT-ND; Status: *; Review: *; Manufacturer Part Number: TLV9002SIYCKR
U1106 = 74LVC1G32GS,132: OR Gate IC 1 Channel 6-XSON, SOT1202 (1x1); Manufacturer: Nexperia; Operating Supply Current: 4 uA; Shutdown Capabilities: No; Category: Logic Gate; Type: OR; Manufacturer Part Number: 74LVC1G32GS,132; Supplier: TBD; Supplier Part Number: TBD; Mounting Type: SMD; Height: 0.46; Supplier 1: Mouser; Supplier Part Number 1: 771-74LVC1G32GS132; Supplier 2: Digikey; Supplier Part Number 2: 1727-74LVC1G32GS,132CT-ND; Supplier 3: Digikey; Supplier Part Number 3: 1727-74LVC1G32GS,132DKR-ND; Supplier 4: Digikey; Supplier Part Number 4: 1727-74LVC1G32GS,132TR-ND